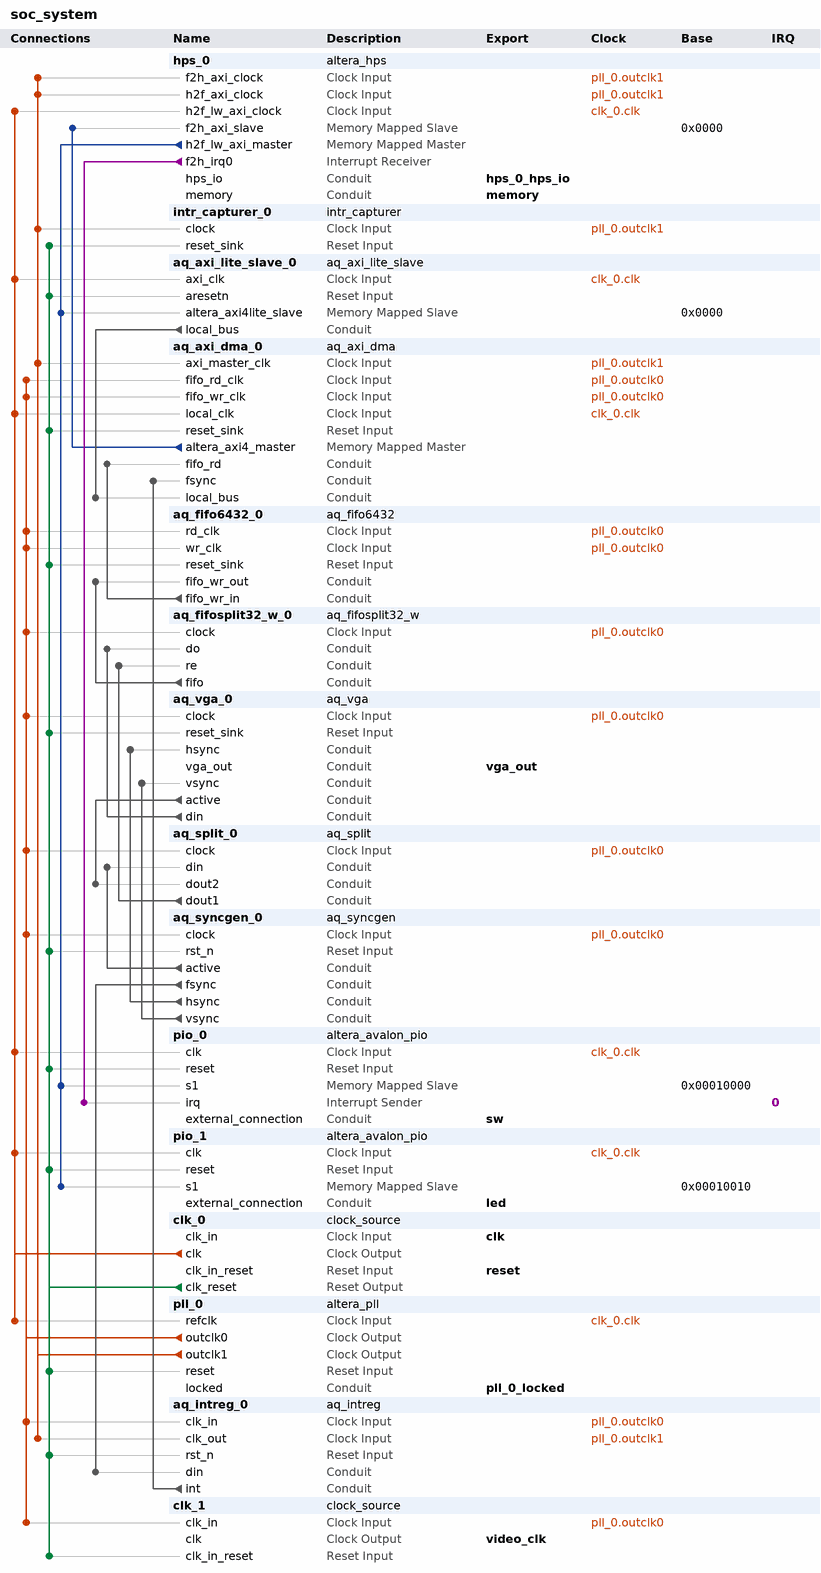
[diagram p0: system contents]
# Platform Designer (Qsys) system soc_system, Cyclone V 5CSEMA5F31C6
# Parameters at their usual value, and those the tool derives, are not listed.
package require -exact qsys 15.1
create_system soc_system
set_project_property DEVICE_FAMILY {Cyclone V}
set_project_property DEVICE 5CSEMA5F31C6

add_instance hps_0 altera_hps 15.1
set_instance_parameter_value hps_0 EMAC1_Mode RGMII
set_instance_parameter_value hps_0 EMAC1_PinMuxing {HPS I/O Set 0}
set_instance_parameter_value hps_0 F2SCLK_COLDRST_Enable false
set_instance_parameter_value hps_0 F2SCLK_DBGRST_Enable false
set_instance_parameter_value hps_0 F2SCLK_WARMRST_Enable false
set_instance_parameter_value hps_0 F2SINTERRUPT_Enable true
set_instance_parameter_value hps_0 F2S_Width 2
set_instance_parameter_value hps_0 FPGA_PERIPHERAL_OUTPUT_CLOCK_FREQ_EMAC0_GTX_CLK 100
set_instance_parameter_value hps_0 FPGA_PERIPHERAL_OUTPUT_CLOCK_FREQ_EMAC0_MD_CLK 100.0
set_instance_parameter_value hps_0 FPGA_PERIPHERAL_OUTPUT_CLOCK_FREQ_EMAC1_GTX_CLK 100
set_instance_parameter_value hps_0 FPGA_PERIPHERAL_OUTPUT_CLOCK_FREQ_EMAC1_MD_CLK 100.0
set_instance_parameter_value hps_0 HPS_PROTOCOL DDR3
set_instance_parameter_value hps_0 I2C0_Mode I2C
set_instance_parameter_value hps_0 I2C0_PinMuxing {HPS I/O Set 0}
set_instance_parameter_value hps_0 I2C1_Mode I2C
set_instance_parameter_value hps_0 I2C1_PinMuxing {HPS I/O Set 0}
set_instance_parameter_value hps_0 LWH2F_Enable true
set_instance_parameter_value hps_0 MEM_BANKADDR_WIDTH 3
set_instance_parameter_value hps_0 MEM_CLK_FREQ 400.0
set_instance_parameter_value hps_0 MEM_COL_ADDR_WIDTH 10
set_instance_parameter_value hps_0 MEM_DQ_WIDTH 32
set_instance_parameter_value hps_0 MEM_DRV_STR RZQ/7
set_instance_parameter_value hps_0 MEM_ROW_ADDR_WIDTH 15
set_instance_parameter_value hps_0 MEM_RTT_NOM RZQ/4
set_instance_parameter_value hps_0 MEM_RTT_WR RZQ/4
set_instance_parameter_value hps_0 MEM_TCL 11
set_instance_parameter_value hps_0 MEM_TFAW_NS 30.0
set_instance_parameter_value hps_0 MEM_TRAS_NS 35.0
set_instance_parameter_value hps_0 MEM_TRCD_NS 13.75
set_instance_parameter_value hps_0 MEM_TRFC_NS 260.0
set_instance_parameter_value hps_0 MEM_TRP_NS 13.75
set_instance_parameter_value hps_0 MEM_VENDOR Micron
set_instance_parameter_value hps_0 MEM_WTCL 8
set_instance_parameter_value hps_0 QSPI_Mode {1 SS}
set_instance_parameter_value hps_0 QSPI_PinMuxing {HPS I/O Set 0}
set_instance_parameter_value hps_0 REF_CLK_FREQ 25.0
set_instance_parameter_value hps_0 S2FCLK_USER2CLK 1
set_instance_parameter_value hps_0 S2F_Width 3
set_instance_parameter_value hps_0 SDIO_Mode {4-bit Data}
set_instance_parameter_value hps_0 SDIO_PinMuxing {HPS I/O Set 0}
set_instance_parameter_value hps_0 SPIM1_Mode {Single Slave Select}
set_instance_parameter_value hps_0 SPIM1_PinMuxing {HPS I/O Set 0}
set_instance_parameter_value hps_0 STM_Enable false
set_instance_parameter_value hps_0 TIMING_BOARD_AC_SKEW 0.02
set_instance_parameter_value hps_0 TIMING_BOARD_AC_TO_CK_SKEW 0.01
set_instance_parameter_value hps_0 TIMING_BOARD_DQ_TO_DQS_SKEW 0.05
set_instance_parameter_value hps_0 TIMING_BOARD_MAX_CK_DELAY 0.03
set_instance_parameter_value hps_0 TIMING_BOARD_MAX_DQS_DELAY 0.02
set_instance_parameter_value hps_0 TIMING_BOARD_SKEW_BETWEEN_DQS 0.06
set_instance_parameter_value hps_0 TIMING_BOARD_SKEW_CKDQS_DIMM_MAX 0.12
set_instance_parameter_value hps_0 TIMING_BOARD_SKEW_CKDQS_DIMM_MIN 0.06
set_instance_parameter_value hps_0 TIMING_BOARD_SKEW_WITHIN_DQS 0.01
set_instance_parameter_value hps_0 TIMING_TDH 65
set_instance_parameter_value hps_0 TIMING_TDQSCK 255
set_instance_parameter_value hps_0 TIMING_TDQSQ 125
set_instance_parameter_value hps_0 TIMING_TDS 30
set_instance_parameter_value hps_0 TIMING_TIH 140
set_instance_parameter_value hps_0 TIMING_TIS 180
set_instance_parameter_value hps_0 TIMING_TQSH 0.4
set_instance_parameter_value hps_0 UART0_Mode {No Flow Control}
set_instance_parameter_value hps_0 UART0_PinMuxing {HPS I/O Set 0}
set_instance_parameter_value hps_0 USB1_Mode SDR
set_instance_parameter_value hps_0 USB1_PinMuxing {HPS I/O Set 0}
set_instance_parameter_value hps_0 desired_cfg_clk_mhz 100.0
set_instance_parameter_value hps_0 desired_qspi_clk_mhz 400.0

add_instance intr_capturer_0 intr_capturer 100.99.98.97

add_instance aq_axi_lite_slave_0 aq_axi_lite_slave 1.0

add_instance aq_axi_dma_0 aq_axi_dma 1.0

add_instance aq_fifo6432_0 aq_fifo6432 1.0

add_instance aq_fifosplit32_w_0 aq_fifosplit32_w 1.0

add_instance aq_vga_0 aq_vga 1.0

add_instance aq_split_0 aq_split 1.0

add_instance aq_syncgen_0 aq_syncgen 1.0

add_instance pio_0 altera_avalon_pio 15.1
set_instance_parameter_value pio_0 direction Input
set_instance_parameter_value pio_0 generateIRQ true
set_instance_parameter_value pio_0 width 4

add_instance pio_1 altera_avalon_pio 15.1
set_instance_parameter_value pio_1 direction Output
set_instance_parameter_value pio_1 width 4

add_instance clk_0 clock_source 15.1
set_instance_parameter_value clk_0 clockFrequency 50000000

add_instance pll_0 altera_pll 15.1
set_instance_parameter_value pll_0 gui_actual_output_clock_frequency0 {64.000000 MHz}
set_instance_parameter_value pll_0 gui_device_speed_grade 1
set_instance_parameter_value pll_0 gui_number_of_clocks 2
set_instance_parameter_value pll_0 gui_operation_mode direct
set_instance_parameter_value pll_0 gui_output_clock_frequency0 65.0
set_instance_parameter_value pll_0 gui_output_clock_frequency1 100.0
set_instance_parameter_value pll_0 gui_pll_mode {Integer-N PLL}
set_instance_parameter_value pll_0 gui_reference_clock_frequency 50.0
set_instance_parameter_value pll_0 gui_use_locked true

add_instance aq_intreg_0 aq_intreg 1.0

add_instance clk_1 clock_source 15.1
set_instance_parameter_value clk_1 clockFrequency 50000000
set_instance_parameter_value clk_1 clockFrequencyKnown false

# connections
add_connection clk_0.clk aq_axi_dma_0.local_clk clock
add_connection clk_0.clk aq_axi_lite_slave_0.axi_clk clock
add_connection clk_0.clk hps_0.h2f_lw_axi_clock clock
add_connection clk_0.clk pio_0.clk clock
add_connection clk_0.clk pio_1.clk clock
add_connection clk_0.clk pll_0.refclk clock
add_connection pll_0.outclk0 aq_axi_dma_0.fifo_rd_clk clock
add_connection pll_0.outclk0 aq_axi_dma_0.fifo_wr_clk clock
add_connection pll_0.outclk0 aq_fifo6432_0.rd_clk clock
add_connection pll_0.outclk0 aq_fifo6432_0.wr_clk clock
add_connection pll_0.outclk0 aq_fifosplit32_w_0.clock clock
add_connection pll_0.outclk0 aq_intreg_0.clk_in clock
add_connection pll_0.outclk0 aq_split_0.clock clock
add_connection pll_0.outclk0 aq_syncgen_0.clock clock
add_connection pll_0.outclk0 aq_vga_0.clock clock
add_connection pll_0.outclk0 clk_1.clk_in clock
add_connection pll_0.outclk1 aq_axi_dma_0.axi_master_clk clock
add_connection pll_0.outclk1 aq_intreg_0.clk_out clock
add_connection pll_0.outclk1 hps_0.f2h_axi_clock clock
add_connection pll_0.outclk1 hps_0.h2f_axi_clock clock
add_connection pll_0.outclk1 intr_capturer_0.clock clock
add_connection clk_0.clk_reset aq_axi_dma_0.reset_sink reset
add_connection clk_0.clk_reset aq_axi_lite_slave_0.aresetn reset
add_connection clk_0.clk_reset aq_fifo6432_0.reset_sink reset
add_connection clk_0.clk_reset aq_intreg_0.rst_n reset
add_connection clk_0.clk_reset aq_syncgen_0.rst_n reset
add_connection clk_0.clk_reset aq_vga_0.reset_sink reset
add_connection clk_0.clk_reset clk_1.clk_in_reset reset
add_connection clk_0.clk_reset intr_capturer_0.reset_sink reset
add_connection clk_0.clk_reset pio_0.reset reset
add_connection clk_0.clk_reset pio_1.reset reset
add_connection clk_0.clk_reset pll_0.reset reset
add_connection aq_axi_dma_0.altera_axi4_master hps_0.f2h_axi_slave avalon
set_connection_parameter_value aq_axi_dma_0.altera_axi4_master/hps_0.f2h_axi_slave baseAddress 0x0000
add_connection hps_0.h2f_lw_axi_master aq_axi_lite_slave_0.altera_axi4lite_slave avalon
set_connection_parameter_value hps_0.h2f_lw_axi_master/aq_axi_lite_slave_0.altera_axi4lite_slave baseAddress 0x0000
add_connection hps_0.h2f_lw_axi_master pio_0.s1 avalon
set_connection_parameter_value hps_0.h2f_lw_axi_master/pio_0.s1 baseAddress 0x00010000
add_connection hps_0.h2f_lw_axi_master pio_1.s1 avalon
set_connection_parameter_value hps_0.h2f_lw_axi_master/pio_1.s1 baseAddress 0x00010010
add_connection aq_axi_lite_slave_0.local_bus aq_axi_dma_0.local_bus conduit
add_connection aq_fifo6432_0.fifo_wr_in aq_axi_dma_0.fifo_rd conduit
add_connection aq_fifosplit32_w_0.fifo aq_fifo6432_0.fifo_wr_out conduit
add_connection aq_intreg_0.int aq_axi_dma_0.fsync conduit
add_connection aq_split_0.dout1 aq_fifosplit32_w_0.re conduit
add_connection aq_syncgen_0.active aq_split_0.din conduit
add_connection aq_syncgen_0.fsync aq_intreg_0.din conduit
add_connection aq_syncgen_0.hsync aq_vga_0.hsync conduit
add_connection aq_syncgen_0.vsync aq_vga_0.vsync conduit
add_connection aq_vga_0.active aq_split_0.dout2 conduit
add_connection aq_vga_0.din aq_fifosplit32_w_0.do conduit
add_connection hps_0.f2h_irq0 pio_0.irq interrupt
set_connection_parameter_value hps_0.f2h_irq0/pio_0.irq irqNumber 0

# exported interfaces
add_interface clk clock sink
set_interface_property clk EXPORT_OF clk_0.clk_in
add_interface hps_0_hps_io conduit end
set_interface_property hps_0_hps_io EXPORT_OF hps_0.hps_io
add_interface led conduit end
set_interface_property led EXPORT_OF pio_1.external_connection
add_interface memory conduit end
set_interface_property memory EXPORT_OF hps_0.memory
add_interface pll_0_locked conduit end
set_interface_property pll_0_locked EXPORT_OF pll_0.locked
add_interface reset reset sink
set_interface_property reset EXPORT_OF clk_0.clk_in_reset
add_interface sw conduit end
set_interface_property sw EXPORT_OF pio_0.external_connection
add_interface vga_out conduit end
set_interface_property vga_out EXPORT_OF aq_vga_0.vga_out
add_interface video_clk clock source
set_interface_property video_clk EXPORT_OF clk_1.clk

set_interconnect_requirement {$system} qsys_mm.clockCrossingAdapter HANDSHAKE
set_interconnect_requirement {$system} qsys_mm.maxAdditionalLatency 1

save_system soc_system.qsys
